# EAGLE design v1 (EAGLE 9.6.2)
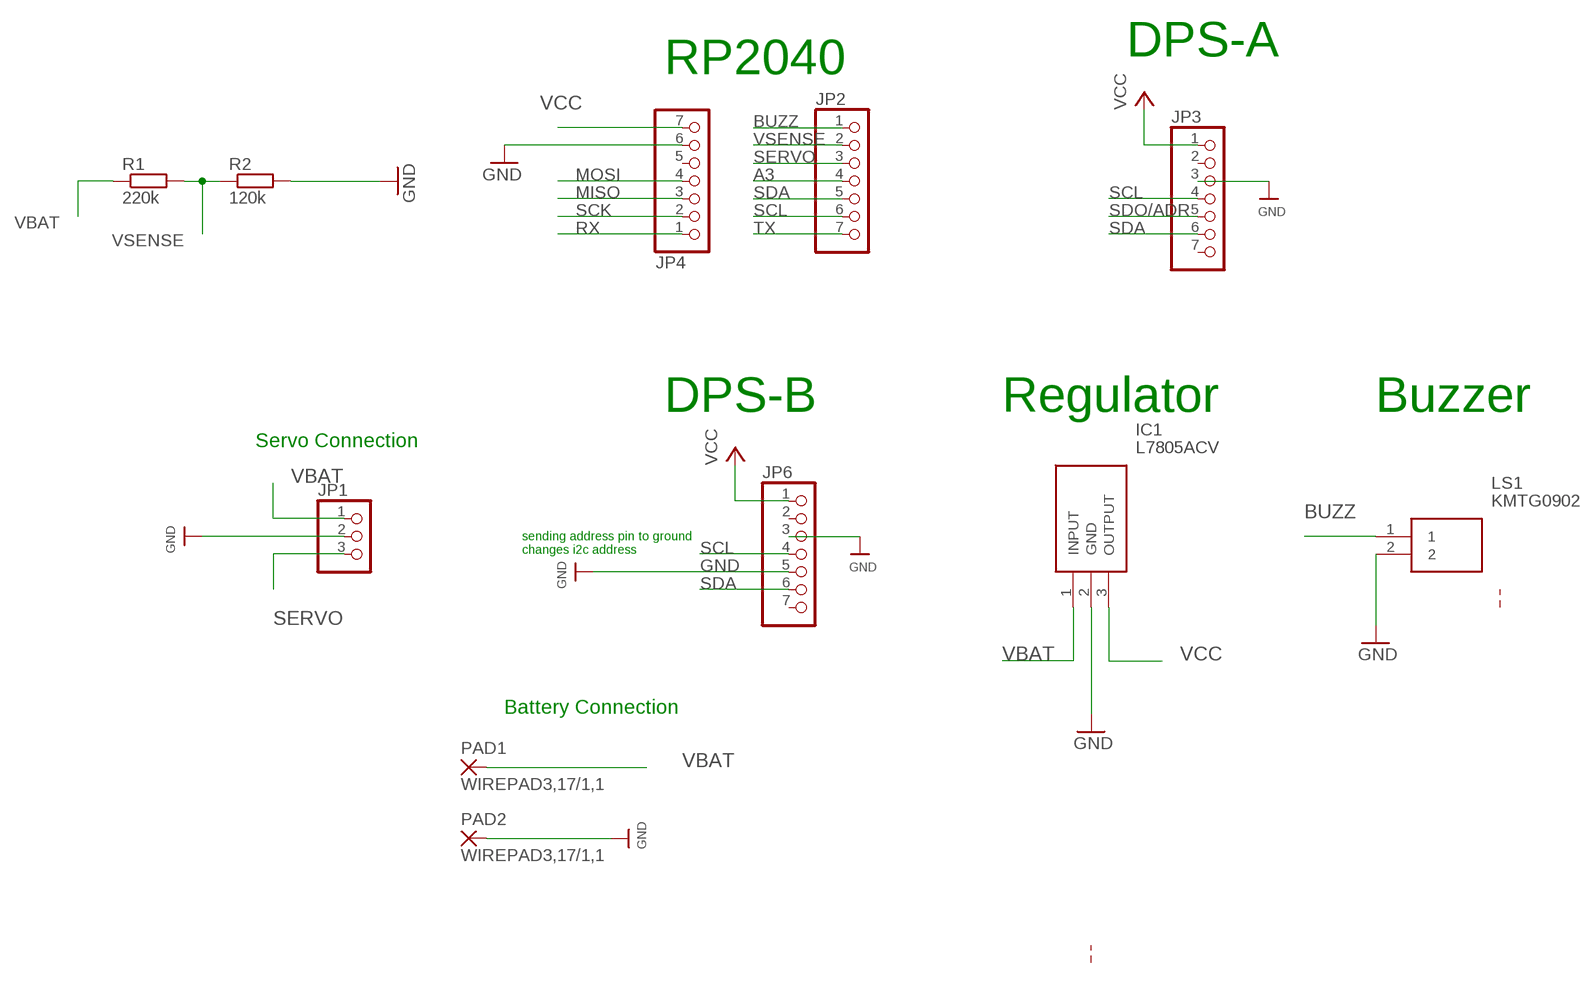
[diagram p0: schematic, sheet 1]

## Parts
IC1  L7805ACV  [TO255P460X1020X2008-3P]
JP1  PINHD-1X3  [1X03]
JP2  HEADER-1X7  [1X07_OVAL]
JP3  HEADER-1X770MIL  [1X07_ROUND_70]
JP4  HEADER-1X7  [1X07_OVAL]
JP6  HEADER-1X770MIL  [1X07_ROUND_70]
LS1  KMTG0902  [KMTG0902]
PAD1  WIREPAD3,17/1,1  [3,17/1,1]
PAD2  WIREPAD3,17/1,1  [3,17/1,1]
R1  220k  R-EU_0204/5  [0204/5]
R2  120k  R-EU_0204/5  [0204/5]

## Nets
A3: JP2.4
BUZZ: JP2.1 LS1.1
GND [highpower]: IC1.2(GND) JP1.2 JP3.3 JP4.6 JP6.3 JP6.5 LS1.2 PAD2.1(P) R2.2
MISO: JP4.3
MOSI: JP4.4
RX: JP4.1
SCK: JP4.2
SCL: JP2.6 JP3.4 JP6.4
SDA: JP2.5 JP3.6 JP6.6
SDO/ADR: JP3.5
SERVO: JP1.3 JP2.3
TX: JP2.7
VBAT: IC1.1(INPUT) JP1.1 PAD1.1(P) R1.1
VCC [highpower]: IC1.3(OUTPUT) JP3.1 JP4.7 JP6.1
VSENSE: JP2.2 R1.2 R2.1
Unconnected: JP3.2 JP3.7 JP4.5 JP6.2 JP6.7

## Notes on the sheet
- DPS-A
- RP2040
- DPS-B | Regulator | Buzzer
- Servo Connection
- sending address pin to ground 
  changes i2c address
- Battery Connection

## Library data of the parts
IC1 = SamacSys_Parts:L7805ACV: Linear voltage regulator,L7805ACV 5V 1A STMicroelectronics L7805ACV, Single Linear Voltage Regulator, 1A 5 V, 2%, 3-Pin TO-220 Source: Datasheet <http://uk.rs-online.com/web/p/products/2988508P>; ALLIED_NUMBER: 70013701; DESCRIPTION: Linear voltage regulator,L7805ACV 5V 1A STMicroelectronics L7805ACV, Single Linear Voltage Regulator, 1A 5 V, 2%, 3-Pin TO-220; HEIGHT: 4.6mm; MANUFACTURER_NAME: STMicroelectronics; MANUFACTURER_PART_NUMBER: L7805ACV; RS_PART_NUMBER: 2988508P; RS_PRICE-STOCK: http://uk.rs-online.com/web/p/products/2988508P
JP1 = pinhead:PINHD-1X3: PIN HEADER
JP2-JP4 JP6 = microbuilder:HEADER-1X7: PIN HEADER
LS1 = SamacSys_Parts:KMTG0902: RS PRO 65 (Minimum)dB SMD Square Wave Piezo Buzzer Source: Datasheet; DESCRIPTION: RS PRO 65 (Minimum)dB SMD Square Wave Piezo Buzzer; HEIGHT: 2.2mm; MANUFACTURER_NAME: RS Components; MANUFACTURER_PART_NUMBER: KMTG0902; RS_PART_NUMBER: 1812715; RS_PRICE-STOCK: https://uk.rs-online.com/web/p/products/1812715
PAD1 PAD2 = wirepad:WIREPAD: Wire PAD connect wire on PCB
R1 R2 = rcl:R-EU_: RESISTOR, European symbol; SPICEPREFIX: R

## Net classes
1 highpower: width 0.305 mm, drill 0.483 mm
2 lowpower: width 0.305 mm, drill 0.483 mm

## Board
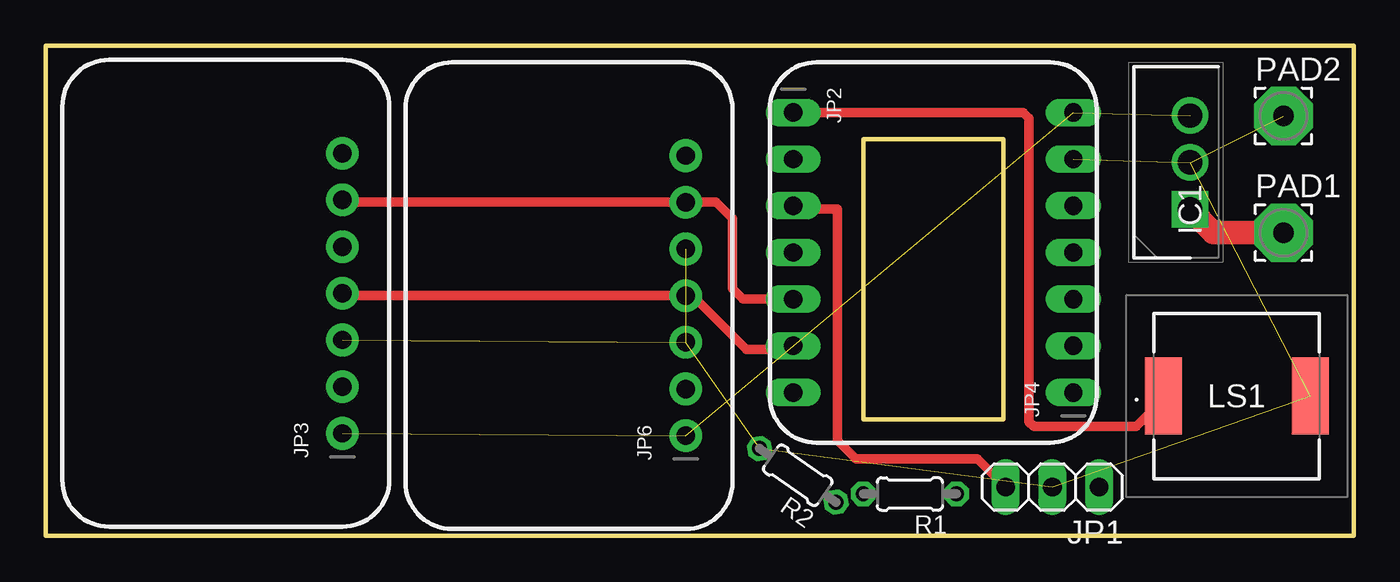
[diagram p1: board, top side]
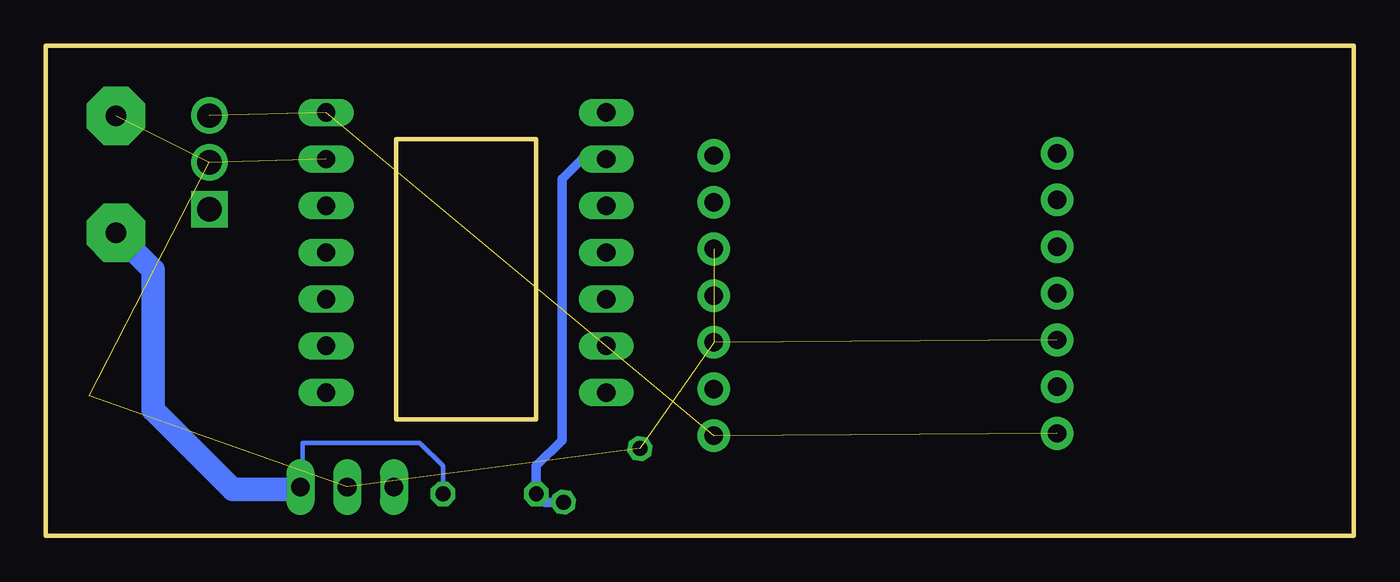
[diagram p2: board, bottom side, seen from below]

Size 71.12 x 26.67 mm. Coordinates in mm from the lower left corner, seen from the top.
Outline: 0,26.67 0,0 71.12,0 71.12,26.67 0,26.67
Outline: 44.45,6.35 52.07,6.35 52.07,21.59 44.45,21.59 44.45,6.35
Copper layers (1*16): Top 0.035mm / dielectric 1.5mm / Bottom 0.035mm
Design rules "default": minimum track width 6mil, minimum drill 0.35mm, track to track 6mil, track to pad 6mil, pad to pad 6mil, via to via 6mil, smd to smd 6mil, copper to edge 40mil, drill to drill 6mil, minimum pad ring 10mil, minimum via ring 8mil, stop-mask expansion 4mil, vias tented up to drill 0mil, thermal gap 10mil

### Footprints (pad centres in the part's own frame; a part is rotated, then mirrored left to right if it is on the bottom)
TO255P460X1020X2008-3P = drill 1.32 pad 1.98 square: 1 0,0 | drill 1.32 pad 1.98: 2 2.55,0; 3 5.1,0
1X03 = drill 1.016 long: 1 -2.54,0; 2 0,0; 3 2.54,0
1X07_OVAL = drill 1 long: 1 -7.62,0; 2 -5.08,0; 3 -2.54,0; 4 0,0; 5 2.54,0; 6 5.08,0; 7 7.62,0
1X07_ROUND_70 = drill 1 pad 1.778: 1 -7.62,0; 2 -5.08,0; 3 -2.54,0; 4 0,0; 5 2.54,0; 6 5.08,0; 7 7.62,0
KMTG0902 = smd 2 x 4.2: 1 -4,0; 2 4,0
3,17/1,1 = drill 1.118 pad 3.175 octagon: 1 0,0
0204/5 = drill 0.813 octagon: 1 -2.54,0; 2 2.54,0

### Placement (x,y rotation side)
IC1  62.23,17.78 90 top
JP1  54.74,2.67 180 top
JP2  40.64,15.43 270 top
JP3  16.13,13.21 90 top
JP4  55.88,15.43 90 top
JP6  34.8,13.08 90 top
LS1  64.77,7.62 0 top
PAD1  67.31,16.51 0 top
PAD2  67.31,22.86 0 top
R1  46.99,2.29 180 top
R2  40.89,3.3 145 top

### Tracks (layer width: path | path; a pad name or v marks a point on that pad's centre or on a via)
BUZZ
  Top 0.508: LS1.1 60.77,7.43 59.31,5.97 53.72,5.97 53.47,6.22 53.47,22.73 53.15,23.05 JP2.1
GND  (8 unrouted)
SCL
  Top 0.508: JP2.6 40.45,10.16 38.1,10.16 35.18,13.08 JP6.4 16.26,13.08 JP3.4
SDA
  Top 0.508: JP2.5 37.91,12.89 37.34,13.46 37.34,17.27 36.45,18.16 JP6.6 16.26,18.16 JP3.6
SERVO
  Top 0.508: JP2.3 40.83,17.78 43.05,17.78 43.05,5.21 44.07,4.19 50.67,4.19 JP1.3
VBAT
  Top 1.27: PAD1.1 63.5,16.51 IC1.1
  Bottom 0.254: JP1.1 57.15,2.79 57.15,5.08 50.8,5.08 49.53,3.81 R1.1
  Bottom 1.27: PAD1.1 65.28,14.48 65.28,6.86 60.96,2.54 57.4,2.54 JP1.1
VCC  (3 unrouted)
VSENSE
  Bottom 0.254: 41.97,20.51 JP2.2
  Bottom 0.508: 41.97,20.51 43.05,19.43 43.05,5.21 44.45,3.81 R1.2 44.01,1.84 R2.1